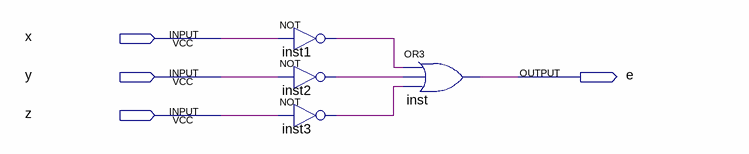
[diagram p0: schematic sheet]
// Quartus schematic Circuito-E.bdf as structural Verilog: 4 symbols, 4 pins
module \Circuito-E  (
  input  x,
  input  y,
  input  z,
  output e
);

  wire inst1_out, inst2_out, inst3_out;

  not inst1 (inst1_out, x);
  not inst2 (inst2_out, y);
  not inst3 (inst3_out, z);
  or inst (e, inst1_out, inst2_out, inst3_out);
endmodule
